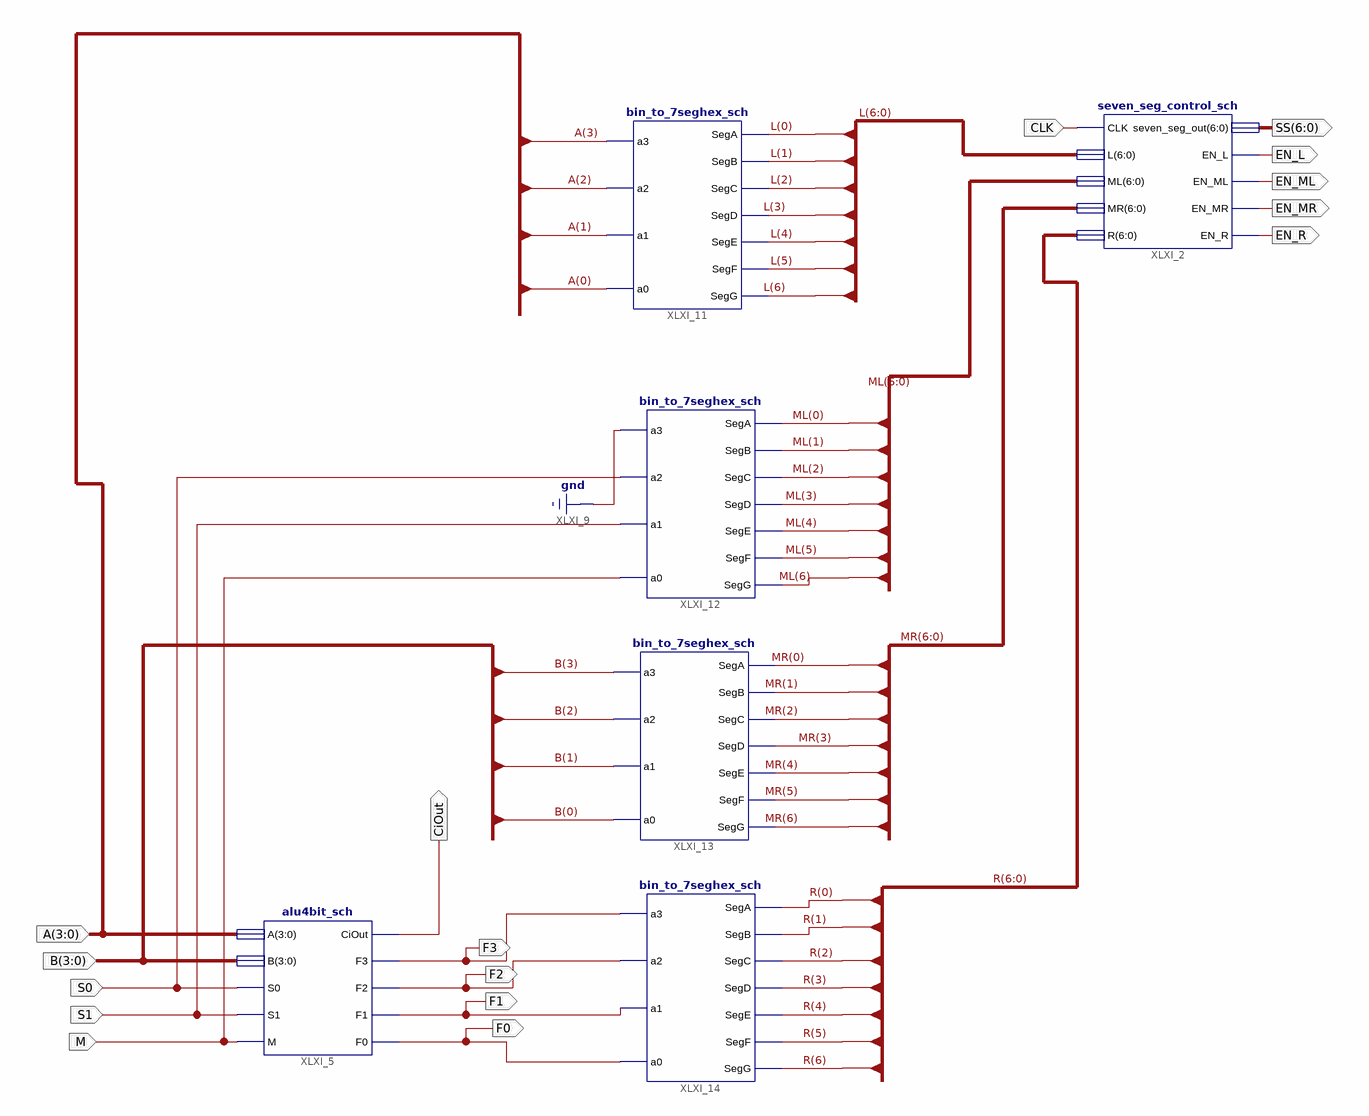
[diagram p0: schematic sheet 1]
// Xilinx ISE schematic alu4bit_board_sch.sch (spartan3e) as structural Verilog: 6 symbols, 16 ports
module alu4bit_board_sch (
  input  CLK,
  input  [3:0] A,
  input  [3:0] B,
  input  S0,
  input  M,
  input  S1,
  output [6:0] SS,
  output EN_L,
  output EN_ML,
  output EN_MR,
  output EN_R,
  output CiOut,
  output F3,
  output F2,
  output F1,
  output F0
);

  wire [6:0] L, ML, MR, R;

  seven_seg_control_sch XLXI_2 (
    .CLK(CLK), .L(L), .ML(ML), .MR(MR), .R(R), .EN_MR(EN_MR), .EN_L(EN_L), .EN_ML(EN_ML), .EN_R(EN_R),
    .seven_seg_out(SS));
  alu4bit_sch XLXI_5 (.A(A), .B(B), .S0(S0), .S1(S1), .M(M), .CiOut(CiOut), .F3(F3), .F2(F2), .F1(F1), .F0(F0));
  bin_to_7seghex_sch XLXI_11 (
    .SegA(L[0]), .SegB(L[1]), .SegC(L[2]), .SegD(L[3]), .SegE(L[4]), .SegF(L[5]), .SegG(L[6]), .a3(A[3]),
    .a0(A[0]), .a1(A[1]), .a2(A[2]));
  bin_to_7seghex_sch XLXI_12 (
    .SegA(ML[0]), .SegB(ML[1]), .SegC(ML[2]), .SegD(ML[3]), .SegE(ML[4]), .SegF(ML[5]), .SegG(ML[6]),
    .a3(1'b0), .a0(M), .a1(S1), .a2(S0));
  bin_to_7seghex_sch XLXI_13 (
    .SegA(MR[0]), .SegB(MR[1]), .SegC(MR[2]), .SegD(MR[3]), .SegE(MR[4]), .SegF(MR[5]), .SegG(MR[6]),
    .a3(B[3]), .a0(B[0]), .a1(B[1]), .a2(B[2]));
  bin_to_7seghex_sch XLXI_14 (
    .SegA(R[0]), .SegB(R[1]), .SegC(R[2]), .SegD(R[3]), .SegE(R[4]), .SegF(R[5]), .SegG(R[6]), .a3(F3),
    .a0(F0), .a1(F1), .a2(F2));
endmodule
